# Altium schematic sheet rev02_6.SchDoc
size 409 x 282 mm
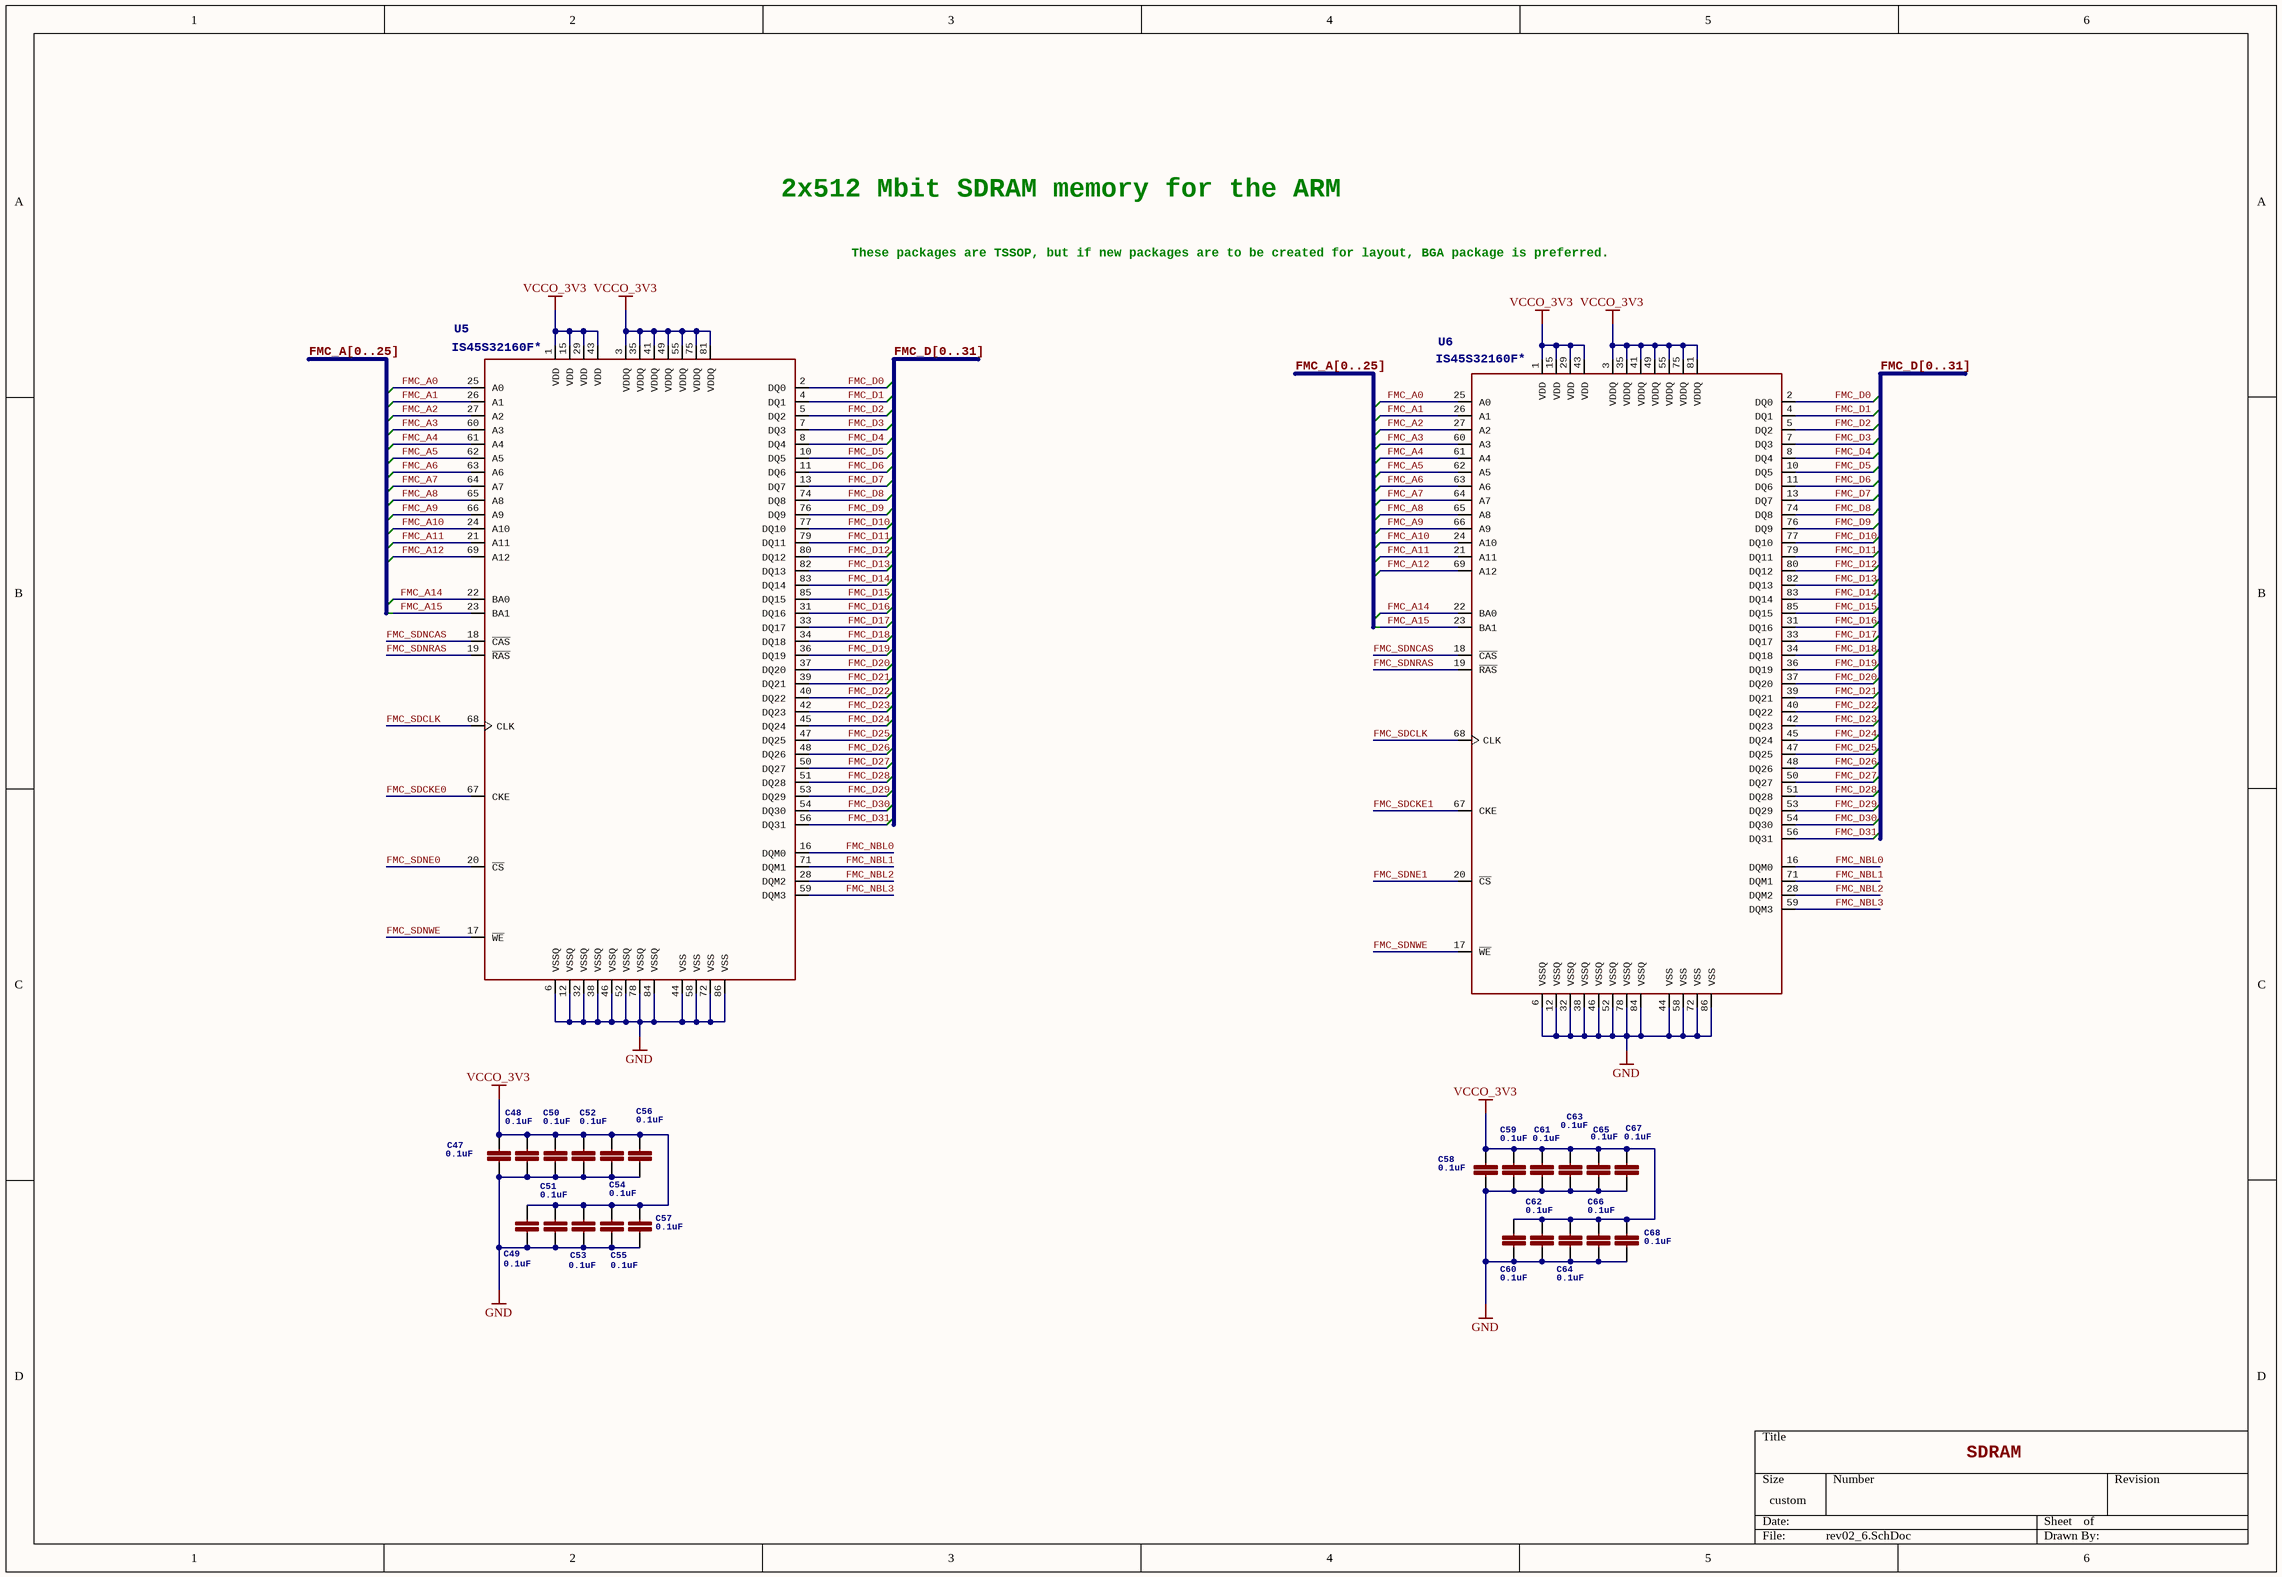
[diagram p0: rev02_6.SchDoc]

## Parts
C47  value 0.1uF  [C_0402]
C48  value 0.1uF  [C_0402]
C49  value 0.1uF  [C_0402]
C50  value 0.1uF  [C_0402]
C51  value 0.1uF  [C_0402]
C52  value 0.1uF  [C_0402]
C53  value 0.1uF  [C_0402]
C54  value 0.1uF  [C_0402]
C55  value 0.1uF  [C_0402]
C56  value 0.1uF  [C_0402]
C57  value 0.1uF  [C_0402]
C58  value 0.1uF  [C_0402]
C59  value 0.1uF  [C_0402]
C60  value 0.1uF  [C_0402]
C61  value 0.1uF  [C_0402]
C62  value 0.1uF  [C_0402]
C63  value 0.1uF  [C_0402]
C64  value 0.1uF  [C_0402]
C65  value 0.1uF  [C_0402]
C66  value 0.1uF  [C_0402]
C67  value 0.1uF  [C_0402]
C68  value 0.1uF  [C_0402]
U5  IS45S32160F*  >NAME: U5  [TSSOP50P1180X120-86N]
U6  IS45S32160F*  >NAME: U6  [TSSOP50P1180X120-86N]

## Nets
GND: C47.2 C48.2 C49.2 C50.2 C51.2 C52.2 C53.2 C54.2 C55.2 C56.2 C57.2 C58.2 C59.2 C60.2 C61.2 C62.2 C63.2 C64.2 C65.2 C66.2 C67.2 C68.2 U5.6(VSSQ) U5.12(VSSQ) U5.32(VSSQ) U5.38(VSSQ) U5.44(VSS) U5.46(VSSQ) U5.52(VSSQ) U5.58(VSS) U5.72(VSS) U5.78(VSSQ) U5.84(VSSQ) U5.86(VSS) U6.6(VSSQ) U6.12(VSSQ) U6.32(VSSQ) U6.38(VSSQ) U6.44(VSS) U6.46(VSSQ) U6.52(VSSQ) U6.58(VSS) U6.72(VSS) U6.78(VSSQ) U6.84(VSSQ) U6.86(VSS)
VCCO_3V3: C47.1 C48.1 C49.1 C50.1 C51.1 C52.1 C53.1 C54.1 C55.1 C56.1 C57.1 C58.1 C59.1 C60.1 C61.1 C62.1 C63.1 C64.1 C65.1 C66.1 C67.1 C68.1 U5.1(VDD) U5.3(VDDQ) U5.15(VDD) U5.29(VDD) U5.35(VDDQ) U5.41(VDDQ) U5.43(VDD) U5.49(VDDQ) U5.55(VDDQ) U5.75(VDDQ) U5.81(VDDQ) U6.1(VDD) U6.3(VDDQ) U6.15(VDD) U6.29(VDD) U6.35(VDDQ) U6.41(VDDQ) U6.43(VDD) U6.49(VDDQ) U6.55(VDDQ) U6.75(VDDQ) U6.81(VDDQ)
FMC_A0: U5.25(A0) U6.25(A0)
FMC_A1: U5.26(A1) U6.26(A1)
FMC_A2: U5.27(A2) U6.27(A2)
FMC_A3: U5.60(A3) U6.60(A3)
FMC_A4: U5.61(A4) U6.61(A4)
FMC_A5: U5.62(A5) U6.62(A5)
FMC_A6: U5.63(A6) U6.63(A6)
FMC_A7: U5.64(A7) U6.64(A7)
FMC_A8: U5.65(A8) U6.65(A8)
FMC_A9: U5.66(A9) U6.66(A9)
FMC_A10: U5.24(A10) U6.24(A10)
FMC_A11: U5.21(A11) U6.21(A11)
FMC_A12: U5.69(A12) U6.69(A12)
FMC_A14: U5.22(BA0) U6.22(BA0)
FMC_A15: U5.23(BA1) U6.23(BA1)
FMC_D0: U5.2(DQ0) U6.2(DQ0)
FMC_D1: U5.4(DQ1) U6.4(DQ1)
FMC_D2: U5.5(DQ2) U6.5(DQ2)
FMC_D3: U5.7(DQ3) U6.7(DQ3)
FMC_D4: U5.8(DQ4) U6.8(DQ4)
FMC_D5: U5.10(DQ5) U6.10(DQ5)
FMC_D6: U5.11(DQ6) U6.11(DQ6)
FMC_D7: U5.13(DQ7) U6.13(DQ7)
FMC_D8: U5.74(DQ8) U6.74(DQ8)
FMC_D9: U5.76(DQ9) U6.76(DQ9)
FMC_D10: U5.77(DQ10) U6.77(DQ10)
FMC_D11: U5.79(DQ11) U6.79(DQ11)
FMC_D12: U5.80(DQ12) U6.80(DQ12)
FMC_D13: U5.82(DQ13) U6.82(DQ13)
FMC_D14: U5.83(DQ14) U6.83(DQ14)
FMC_D15: U5.85(DQ15) U6.85(DQ15)
FMC_D16: U5.31(DQ16) U6.31(DQ16)
FMC_D17: U5.33(DQ17) U6.33(DQ17)
FMC_D18: U5.34(DQ18) U6.34(DQ18)
FMC_D19: U5.36(DQ19) U6.36(DQ19)
FMC_D20: U5.37(DQ20) U6.37(DQ20)
FMC_D21: U5.39(DQ21) U6.39(DQ21)
FMC_D22: U5.40(DQ22) U6.40(DQ22)
FMC_D23: U5.42(DQ23) U6.42(DQ23)
FMC_D24: U5.45(DQ24) U6.45(DQ24)
FMC_D25: U5.47(DQ25) U6.47(DQ25)
FMC_D26: U5.48(DQ26) U6.48(DQ26)
FMC_D27: U5.50(DQ27) U6.50(DQ27)
FMC_D28: U5.51(DQ28) U6.51(DQ28)
FMC_D29: U5.53(DQ29) U6.53(DQ29)
FMC_D30: U5.54(DQ30) U6.54(DQ30)
FMC_D31: U5.56(DQ31) U6.56(DQ31)
FMC_NBL0: U5.16(DQM0) U6.16(DQM0)
FMC_NBL1: U5.71(DQM1) U6.71(DQM1)
FMC_NBL2: U5.28(DQM2) U6.28(DQM2)
FMC_NBL3: U5.59(DQM3) U6.59(DQM3)
FMC_SDCKE0: U5.67(CKE)
FMC_SDCKE1: U6.67(CKE)
FMC_SDCLK: U5.68(CLK) U6.68(CLK)
FMC_SDNCAS: U5.18(~{CAS}) U6.18(~{CAS})
FMC_SDNE0: U5.20(~{CS})
FMC_SDNE1: U6.20(~{CS})
FMC_SDNRAS: U5.19(~{RAS}) U6.19(~{RAS})
FMC_SDNWE: U5.17(~{WE}) U6.17(~{WE})

## Buses and harness runs
bus FMC_A[0..25]
bus FMC_D[0..31]

## Notes on the sheet
- 2x512 Mbit SDRAM memory for the ARM
- These packages are TSSOP, but if new packages are to be created
  for layout, BGA package is preferred.
- SDRAM

## Library data of the parts
C47-C68 = C-EUC0402: 0402 CAPACITOR
U5 U6 = IS45S32160F: 16Mx32, 512Mb SDRAM / Clock frequency: 166, 143 MHz; MPN: IS45S32160F; SUPPLIER: ISSI; >VALUE: IS45S32160F